# Altium schematic sheet 05021002_Accelerometer.SchDoc: Ipê Board
size A4; Organization: Cerebra SC; Address1: R. Coriolano José Gilbertone; Address2: Jd. Paulista; Address3: n° 703; Address4: São Carlos - Brasil; DocumentNumber: 7; Revision: A; SheetNumber: 7; SheetTotal: 8
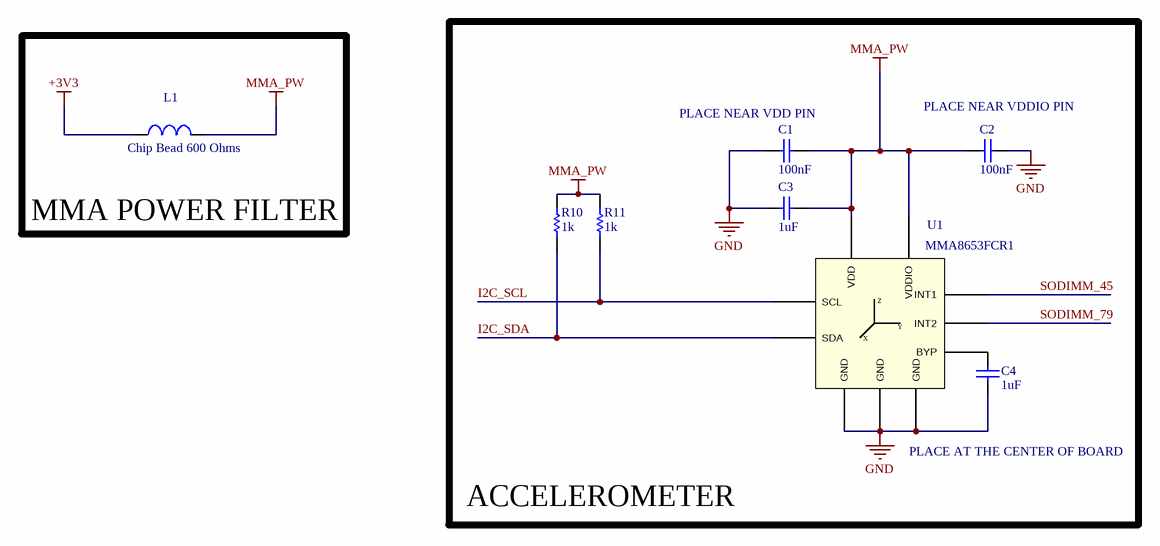
[diagram p0: 05021002_Accelerometer.SchDoc]

## Parts
C1  100nF  [CAPC2012X135N]
C2  100nF  [CAPC2012X135N]
C3  1uF  [CAPC2012X135N]
C4  1uF  [CAPC2012X135N]
L1  Chip Bead 600 Ohms  [1608[0603]]
R10  1k  [0805]
R11  1k  [0805]
U1  MMA8653FCR1  [MMA8653F]

## Blocks framed on the sheet
ACCELEROMETER: C1-C4 R10 R11 U1
MMA POWER FILTER: L1

## Nets
+3V3: L1.1
GND: C1.1 C2.2 C3.1 C4.1 U1.6(GND) U1.7(GND) U1.9(GND)
MMA_PW: C1.2 C2.1 C3.2 L1.2 R10.2 R11.2 U1.1(VDD) U1.8(VDDIO)
I2C_SCL: R11.1 U1.2(SCL)
I2C_SDA: R10.1 U1.10(SDA)
SODIMM_45: U1.3(INT1)
SODIMM_79: U1.5(INT2)
NetC4_2: C4.2 U1.4(BYP)

## Notes on the sheet
- (near C1) PLACE NEAR VDD PIN
- (near C2) PLACE NEAR VDDIO PIN
- PLACE AT THE CENTER OF BOARD
- Title
- Size:
- Date:
- A4
- Number:
- Time:
- Revision:
- Sheet
- of
- File:
- (in symbol MMA8653FCR1) Z; Y; X

## Library data of the parts
C1 C2 = capacitor_gen: Generic Capacitor; Part Number 1: 885012207016; Manufacturer 1: Wurth Electronics Inc; Value: 100nF
C3 C4 = capacitor_gen: Generic Capacitor; Part Number 1: 0805ZC105KAT2A; Manufacturer 1: AVX Corporation; Value: 1uF
L1 = L: Wide Band Bead 600 Ohms - Rdc 0.45 mOhms 74279265; Manufacturer 1: Wurth Electronics Inc; Value: 600 Ohms; Part Number 1: 742 792 65
R10 R11 = resistor_gen: Part Number 1: RC0805JR-071KL; Manufacturer 1: Yageo; Value: 1k
U1 = MMA8653FCR1: Manufacturer 1: Freescale Semiconductor - NXP; Part Number 1: MMA8653FCR1